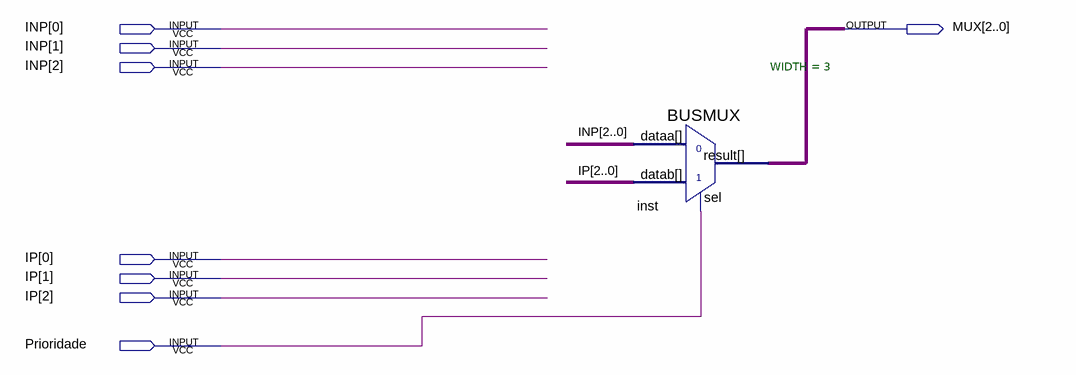
[diagram p0: schematic sheet]
// Quartus schematic Multiplexador_Elevador.bdf as structural Verilog: 1 symbols, 8 pins
module Multiplexador_Elevador (
  input  [2:0] INP,
  input  [2:0] IP,
  input  Prioridade,
  output [2:0] MUX
);

  BUSMUX #(.WIDTH(3)) inst (.datab(IP), .sel(Prioridade), .dataa(INP), .result(MUX));
endmodule
